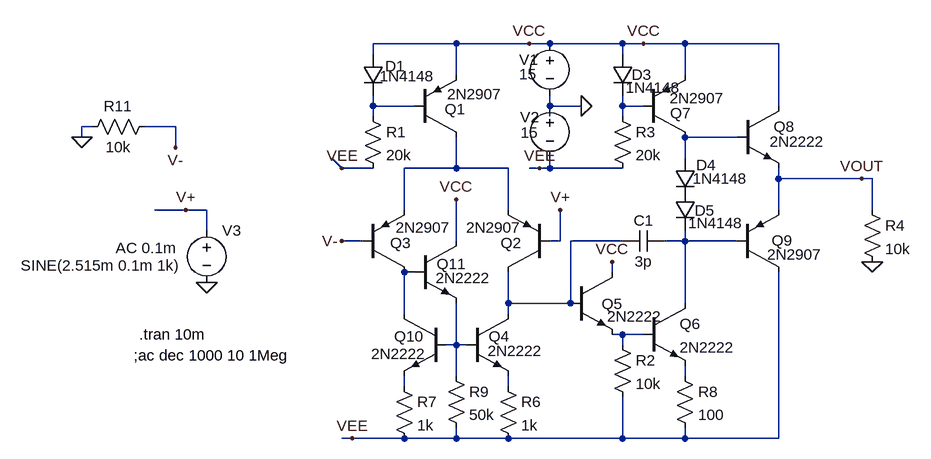
[diagram p0: schematic lm741.asc]
lm741.asc, the LTspice schematic file:
Version 4
SHEET 1 880 724
WIRE 48 64 -80 64
WIRE 160 64 48 64
WIRE 192 64 160 64
WIRE 304 64 192 64
WIRE 336 64 304 64
WIRE 400 64 336 64
WIRE 544 64 400 64
WIRE -80 80 -80 64
WIRE 304 80 304 64
WIRE 48 112 48 64
WIRE 400 112 400 64
WIRE -80 160 -80 144
WIRE -16 160 -80 160
WIRE 192 160 192 144
WIRE 240 160 192 160
WIRE 304 160 304 144
WIRE 336 160 304 160
WIRE 544 160 544 64
WIRE -80 176 -80 160
WIRE 192 176 192 160
WIRE 304 176 304 160
WIRE -512 192 -528 192
WIRE -384 192 -432 192
WIRE -528 208 -528 192
WIRE 480 208 400 208
WIRE -384 224 -384 192
WIRE 400 240 400 208
WIRE -128 256 -144 240
WIRE -80 256 -128 256
WIRE 48 256 48 208
WIRE 48 256 -32 256
WIRE 128 256 48 256
WIRE 176 256 160 256
WIRE 192 256 192 240
WIRE 192 256 176 256
WIRE 304 256 192 256
WIRE 544 272 544 256
WIRE 672 272 544 272
WIRE 688 272 672 272
WIRE 400 304 400 288
WIRE -368 320 -416 320
WIRE -336 320 -368 320
WIRE -32 320 -32 256
WIRE 128 320 128 256
WIRE 544 320 544 272
WIRE 688 320 688 272
WIRE -336 352 -336 320
WIRE -96 368 -128 368
WIRE 48 368 48 304
WIRE 208 368 208 320
WIRE 208 368 192 368
WIRE 304 368 224 368
WIRE 400 368 400 352
WIRE 400 368 368 368
WIRE 480 368 400 368
WIRE -16 416 -32 416
WIRE 288 416 288 400
WIRE 128 464 128 416
WIRE 224 464 224 368
WIRE 224 464 128 464
WIRE 400 464 400 368
WIRE -32 480 -32 416
WIRE 128 480 128 464
WIRE 304 512 288 512
WIRE 336 512 304 512
WIRE 48 528 48 464
WIRE 48 528 32 528
WIRE 64 528 48 528
WIRE 304 528 304 512
WIRE 48 576 48 528
WIRE 400 576 400 560
WIRE -32 592 -32 576
WIRE 128 592 128 576
WIRE -112 672 -128 672
WIRE -32 672 -112 672
WIRE 48 672 48 656
WIRE 48 672 -32 672
WIRE 128 672 48 672
WIRE 304 672 304 608
WIRE 304 672 128 672
WIRE 400 672 400 656
WIRE 400 672 304 672
WIRE 544 672 544 416
WIRE 544 672 400 672
FLAG -128 256 VEE
FLAG 336 64 VCC
FLAG -112 672 VEE
FLAG 288 400 VCC
FLAG 672 272 VOUT
FLAG -128 368 V-
FLAG 208 320 V+
FLAG 240 160 0
FLAG 160 64 VCC
FLAG 176 256 VEE
FLAG 688 400 0
FLAG -336 432 0
FLAG -384 224 V-
FLAG 48 304 VCC
FLAG -528 208 0
FLAG -368 320 V+
SYMBOL pnp -16 208 M180
WINDOW 0 46 43 Left 2
WINDOW 3 50 66 Left 2
SYMATTR InstName Q1
SYMATTR Value 2N2907
SYMBOL pnp 192 416 R180
WINDOW 0 43 45 Left 2
WINDOW 3 44 69 Left 2
SYMATTR InstName Q2
SYMATTR Value 2N2907
SYMBOL pnp -96 416 M180
WINDOW 0 42 45 Left 2
WINDOW 3 51 69 Left 2
SYMATTR InstName Q3
SYMATTR Value 2N2907
SYMBOL diode -96 80 R0
WINDOW 0 35 19 Left 2
WINDOW 3 26 34 Left 2
SYMATTR InstName D1
SYMATTR Value 1N4148
SYMBOL npn 64 480 R0
WINDOW 0 34 35 Left 2
WINDOW 3 32 57 Left 2
SYMATTR InstName Q4
SYMATTR Value 2N2222
SYMBOL res -96 160 R0
SYMATTR InstName R1
SYMATTR Value 20k
SYMBOL npn 224 416 R0
WINDOW 0 48 49 Left 2
SYMATTR InstName Q5
SYMATTR Value 2N2222
SYMBOL npn 336 464 R0
SYMATTR InstName Q6
SYMATTR Value 2N2222
SYMBOL res 288 512 R0
SYMATTR InstName R2
SYMATTR Value 10k
SYMBOL cap 368 352 R90
WINDOW 0 0 32 VBottom 2
WINDOW 3 32 32 VTop 2
SYMATTR InstName C1
SYMATTR Value 3p
SYMBOL pnp 336 208 M180
WINDOW 0 41 37 Left 2
WINDOW 3 40 60 Left 2
SYMATTR InstName Q7
SYMATTR Value 2N2907
SYMBOL diode 288 80 R0
WINDOW 0 30 32 Left 2
WINDOW 3 21 52 Left 2
SYMATTR InstName D3
SYMATTR Value 1N4148
SYMBOL res 288 160 R0
SYMATTR InstName R3
SYMATTR Value 20k
SYMBOL diode 384 240 R0
WINDOW 0 33 11 Left 2
WINDOW 3 28 32 Left 2
SYMATTR InstName D4
SYMATTR Value 1N4148
SYMBOL diode 384 288 R0
WINDOW 0 31 33 Left 2
WINDOW 3 21 52 Left 2
SYMATTR InstName D5
SYMATTR Value 1N4148
SYMBOL npn 480 160 R0
WINDOW 3 50 55 Left 2
SYMATTR InstName Q8
SYMATTR Value 2N2222
SYMBOL pnp 480 416 M180
WINDOW 0 53 49 Left 2
WINDOW 3 46 27 Left 2
SYMATTR InstName Q9
SYMATTR Value 2N2907
SYMBOL voltage 192 48 R0
WINDOW 123 0 0 Left 2
WINDOW 39 0 0 Left 2
WINDOW 0 -47 41 Left 2
WINDOW 3 -47 63 Left 2
SYMATTR InstName V1
SYMATTR Value 15
SYMBOL voltage 192 144 R0
WINDOW 123 0 0 Left 2
WINDOW 39 0 0 Left 2
WINDOW 0 -46 33 Left 2
WINDOW 3 -45 57 Left 2
SYMATTR InstName V2
SYMATTR Value 15
SYMBOL res 672 304 R0
SYMATTR InstName R4
SYMATTR Value 10k
SYMBOL voltage -336 336 R0
WINDOW 123 -140 43 Left 2
WINDOW 39 0 0 Left 2
WINDOW 3 -286 70 Left 2
SYMATTR Value2 AC 0.1m
SYMATTR InstName V3
SYMATTR Value SINE(2.515m 0.1m 1k)
SYMBOL res 112 576 R0
SYMATTR InstName R6
SYMATTR Value 1k
SYMBOL res 384 560 R0
SYMATTR InstName R8
SYMATTR Value 100
SYMBOL npn 32 480 M0
WINDOW 0 34 35 Left 2
WINDOW 3 30 62 Left 2
SYMATTR InstName Q10
SYMATTR Value 2N2222
SYMBOL res -48 576 R0
SYMATTR InstName R7
SYMATTR Value 1k
SYMBOL npn -16 368 R0
WINDOW 0 34 35 Left 2
WINDOW 3 32 57 Left 2
SYMATTR InstName Q11
SYMATTR Value 2N2222
SYMBOL res 32 560 R0
SYMATTR InstName R9
SYMATTR Value 50k
SYMBOL res -416 176 R90
WINDOW 0 0 56 VBottom 2
WINDOW 3 32 56 VTop 2
SYMATTR InstName R11
SYMATTR Value 10k
TEXT -440 512 Left 2 !.tran 10m
TEXT -448 544 Left 2 !;ac dec 1000 10 1Meg

The netlist it stands for:
* lm741.asc
Q1 N004 N001 VCC 0 2N2907
Q2 N006 V+ N004 0 2N2907
Q3 N008 V- N004 0 2N2907
D1 VCC N001 1N4148
Q4 N006 N010 N013 0 2N2222
R1 N001 VEE 20k
Q5 VCC N006 N009 0 2N2222
Q6 N007 N009 N011 0 2N2222
R2 N009 VEE 10k
C1 N007 N006 3p
Q7 N003 N002 VCC 0 2N2907
D3 VCC N002 1N4148
R3 N002 VEE 20k
D4 N003 N005 1N4148
D5 N005 N007 1N4148
Q8 VCC N003 VOUT 0 2N2222
Q9 VEE N007 VOUT 0 2N2907
V1 VCC 0 15
V2 0 VEE 15
R4 VOUT 0 10k
V3 V+ 0 SINE(2.515m 0.1m 1k) AC 0.1m
R6 N013 VEE 1k
R8 N011 VEE 100
Q10 N008 N010 N012 0 2N2222
R7 N012 VEE 1k
Q11 VCC N008 N010 0 2N2222
R9 N010 VEE 50k
R11 V- 0 10k
.model D D
.lib standard.dio
.model NPN NPN
.model PNP PNP
.lib standard.bjt
.tran 10m
;ac dec 1000 10 1Meg
.backanno
.end